# Altium schematic sheet MotorDriver.SchDoc
size A4
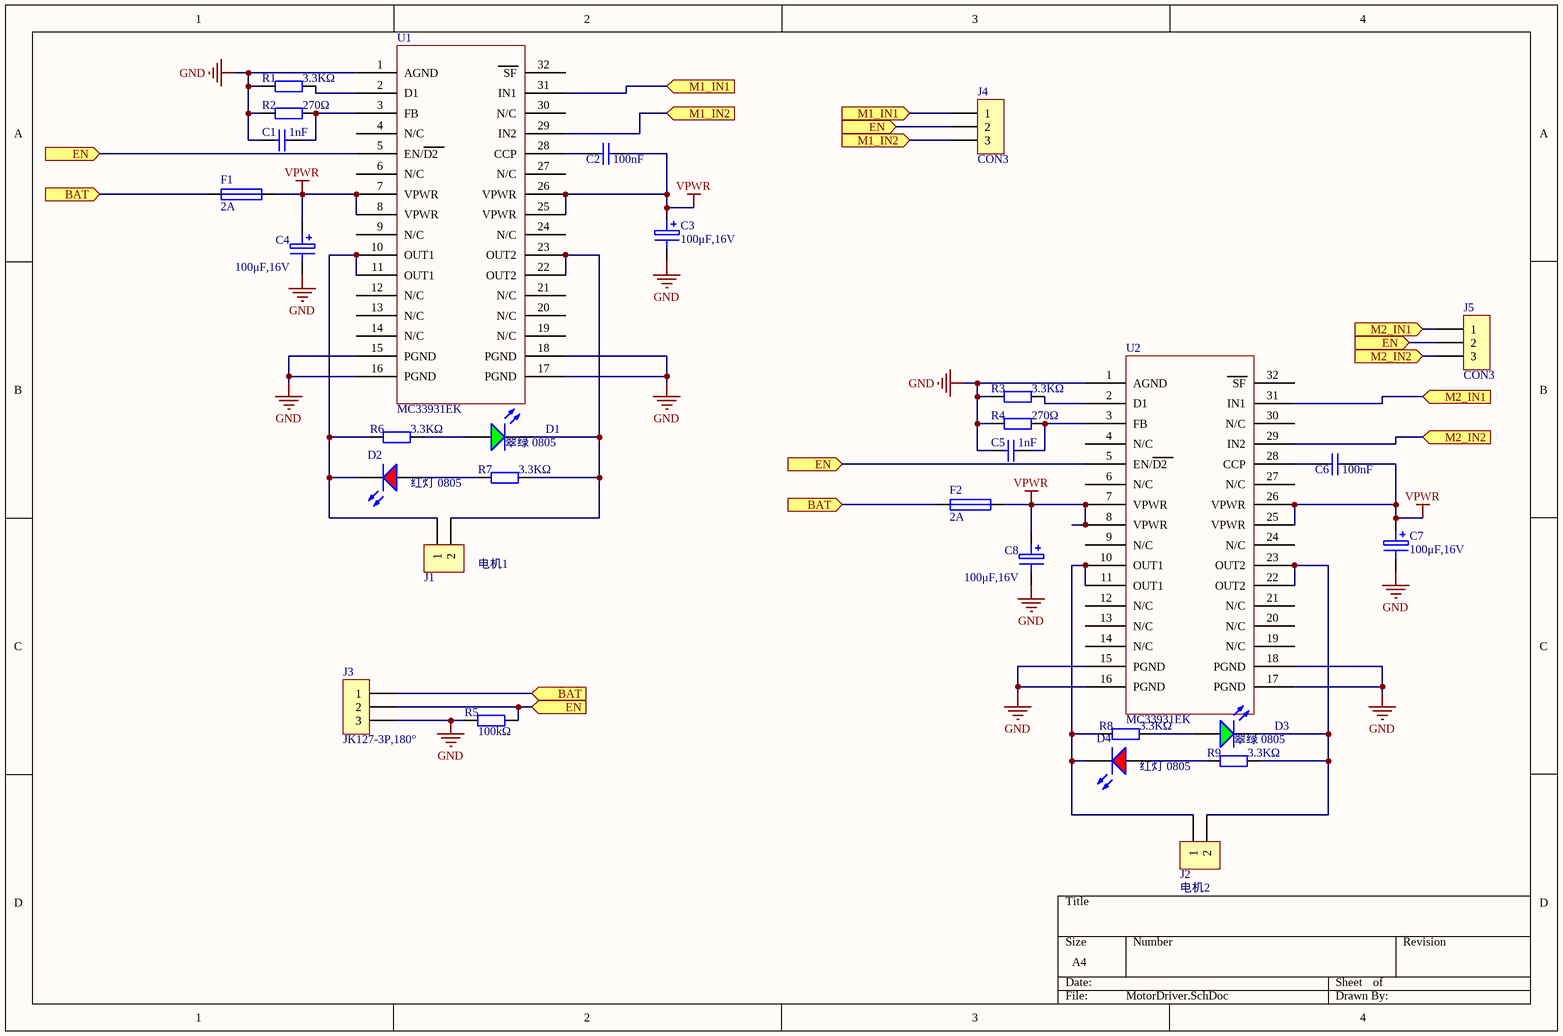
[diagram p0: MotorDriver.SchDoc]

## Parts
C1  1nF  [0805_C]
C2  100nF  [0805_C]
C3  100μF,16V  [RB-220T]
C4  100μF,16V  [RB-220T]
C5  1nF  [0805_C]
C6  100nF  [0805_C]
C7  100μF,16V  [RB-220T]
C8  100μF,16V  [RB-220T]
D1  翠绿 0805  [0805_LED_S1]
D2  红灯 0805  [0805_LED_S1]
D3  翠绿 0805  [0805_LED_S1]
D4  红灯 0805  [0805_LED_S1]
F1  2A  [1812]
F2  2A  [1812]
J1  value 电机1  [COMZ-2-5.0]  (hidden comment: CON2)
J2  value 电机2  [COMZ-2-5.0]  (hidden comment: CON2)
J3  value JK127-3P,180°  [COMZ-3-5.0]  (hidden comment: CON3)
J4  CON3  [SIP-3]
J5  CON3  [SIP-3]
R1  3.3KΩ  [0805_R]
R2  270Ω  [0805_R]
R3  3.3KΩ  [0805_R]
R4  270Ω  [0805_R]
R5  100kΩ  [0805_R]
R6  3.3KΩ  [0805_R]
R7  3.3KΩ  [0805_R]
R8  3.3KΩ  [0805_R]
R9  3.3KΩ  [0805_R]
U1  MC33931EK  [MC33931EK_SOP32]
U2  MC33931EK  [MC33931EK_SOP32]

## Ports
BAT (in), EN (in), M1_IN1 (in), M1_IN2 (in), M2_IN1 (in), M2_IN2 (in)

## Nets
GND: C1.1 C3.2 C4.2 C5.1 C7.2 C8.2 J3.3 R1.1 R2.1 R3.1 R4.1 R5.2 U1.1(AGND) U1.15(PGND) U1.16(PGND) U1.17(PGND) U1.18(PGND) U2.1(AGND) U2.15(PGND) U2.16(PGND) U2.17(PGND) U2.18(PGND)
VPWR: C2.2 C3.1 C4.1 C6.2 C7.1 C8.1 F1.2 F2.2 U1.7(VPWR) U1.8(VPWR) U1.25(VPWR) U1.26(VPWR) U2.7(VPWR) U2.8(VPWR) U2.25(VPWR) U2.26(VPWR)
BAT: F1.1 F2.1 J3.1 ; port BAT
EN: J3.2 J4.2 J5.2 R5.1 U1.5(EN/D2) U2.5(EN/D2) ; port EN
M1_IN1: J4.1 U1.31(IN1) ; port M1_IN1
M1_IN2: J4.3 U1.29(IN2) ; port M1_IN2
M2_IN1: J5.1 U2.31(IN1) ; port M2_IN1
M2_IN2: J5.3 U2.29(IN2) ; port M2_IN2
NetC1_2: C1.2 R2.2 U1.3(FB)
NetC2_1: C2.1 U1.28(CCP)
NetC5_2: C5.2 R4.2 U2.3(FB)
NetC6_1: C6.1 U2.28(CCP)
NetD1_A: D1.A R6.2
NetD1_K: D1.K J1.2 R7.2 U1.22(OUT2) U1.23(OUT2)
NetD2_A: D2.A R7.1
NetD2_K: D2.K J1.1 R6.1 U1.10(OUT1) U1.11(OUT1)
NetD3_A: D3.A R8.2
NetD3_K: D3.K J2.2 R9.2 U2.22(OUT2) U2.23(OUT2)
NetD4_A: D4.A R9.1
NetD4_K: D4.K J2.1 R8.1 U2.10(OUT1) U2.11(OUT1)
NetR1_2: R1.2 U1.2(D1)
NetR3_2: R3.2 U2.2(D1)

Not connected (* = marked no-connect by the designer): U1 4(N/C) 6(N/C) 9(N/C) 12(N/C) 13(N/C) 14(N/C) 19(N/C) 20(N/C) 21(N/C) 24(N/C) 27(N/C) 30(N/C) 32(SF); U2 4(N/C) 6(N/C) 9(N/C) 12(N/C) 13(N/C) 14(N/C) 19(N/C) 20(N/C) 21(N/C) 24(N/C) 27(N/C) 30(N/C) 32(SF)

## Library data of the parts
C1 C5 = 0805 1nF (102) 10% 50V: 贴片电容; ComponentLink1Description: 供应商链接; ComponentLink1URL: http://www.szlcsc.com/product/details_52223.html; Package: 0805; Supplier: LC; SuppliersPartNumber: C51210
C2 C6 = 0805 100nF(104) 10% 50V: 贴片电容; ComponentLink1Description: 供应商链接; ComponentLink1URL: http://www.szlcsc.com/product/details_50686.html; Package: 0805; Supplier: LC; SuppliersPartNumber: C49678
C3 C4 C7 C8 = CAP ELECTRO1: Electrolytic Capacitor; 物料代码: 1.02.06.0002; 名称: V型铝电解电容; 规格型号: 220μF,16V,Ф6.3×7.7mm,,珠海华冠,RoHS; 厂商: 珠海华冠; 贴片和直插: SMT; 现有库存: 4627; Value: 100μF,16V; RoHS: RoHS; ComponentLink1Description: ErpDataInfo; ComponentLink1URL: http://192.168.0.2:8012/ErpExt/ErpData/ListMateriel.aspx?pkey=1.02.06.0002
D1 D3 = 0805 翠绿: 发光二极管; ComponentLink1Description: 供应商链接; ComponentLink1URL: http://www.szlcsc.com/product/details_2670.html; Package: 0805; Supplier: LC; SuppliersPartNumber: C2297
D2 D4 = 0805 红灯: 发光二极管; ComponentLink1Description: 供应商链接; ComponentLink1URL: http://www.szlcsc.com/product/details_2668.html; Package: 0805; Supplier: LC; SuppliersPartNumber: C2295
F1 F2 = FUSE1: Fuse; 物料代码: 1.06.03.0003; 名称: 自恢复保险丝; 规格型号: SMD200,1812,RoHS; 设备封装名称: 1812_SMD200; 贴片和直插: SMT; Value: 2A; 封装: 1812; RoHS: RoHS; ComponentLink1Description: ErpDataInfo; ComponentLink1URL: http://erp.zlgmcu.com/ErpExt/ErpData/ListMateriel.aspx?pkey=1.06.03.0003
J1 J2 = CON2: Connector; 物料代码: 1.10.06.0070; 名称: 端子; 规格型号: DG127-5.08-2P,180°,绿色,DEGSON; 厂商: DEGSON; 贴片和直插: THT; 现有库存: 1077; RoHS: RoHS; ComponentLink1Description: ErpDataInfo; ComponentLink1URL: http://192.168.0.2:8012/ErpExt/ErpData/ListMateriel.aspx?pkey=1.10.06.0070
J3 = CON3_2: Connector; 物料代码: 1.10.06.0042; 名称: 端子; 规格型号: JK127-3P,180°,,雷普电器; 厂商: 雷普电器; 贴片和直插: THT; 现有库存: 2587; ComponentLink1Description: ErpDataInfo; ComponentLink1URL: http://192.168.0.2:8012/ErpExt/ErpData/ListMateriel.aspx?pkey=1.10.06.0042
J4 J5 = CON3_1: Connector
R1-R9 = 0805 3.3KΩ (3301) 1%: 贴片电阻; ComponentLink1Description: 供应商链接; ComponentLink1URL: http://www.szlcsc.com/product/details_26753.html; Package: 0805; Supplier: LC; SuppliersPartNumber: C26010